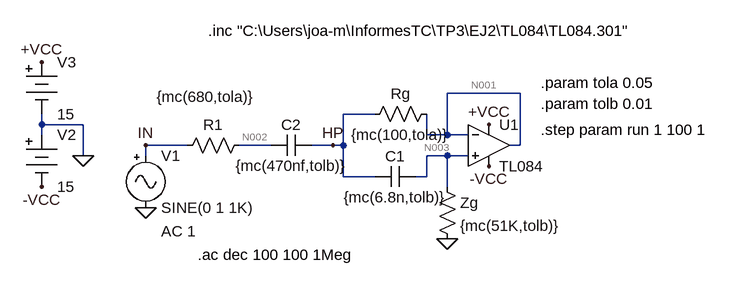
[diagram p0: schematic gyrator_Highpass_montecarlo.asc]
gyrator_Highpass_montecarlo.asc, the LTspice schematic file:
Version 4
SHEET 1 880 680
WIRE 192 80 80 80
WIRE -32 112 -80 112
WIRE -544 128 -544 112
WIRE -480 128 -544 128
WIRE -544 144 -544 128
WIRE 48 144 48 112
WIRE 80 144 80 80
WIRE 80 144 48 144
WIRE 112 144 80 144
WIRE -320 160 -384 160
WIRE -192 160 -240 160
WIRE -96 160 -128 160
WIRE -80 160 -80 112
WIRE -80 160 -96 160
WIRE 192 160 192 80
WIRE 192 160 176 160
WIRE -480 176 -480 128
WIRE -384 176 -384 160
WIRE 80 176 48 176
WIRE 112 176 80 176
WIRE -80 208 -80 160
WIRE -32 208 -80 208
WIRE 48 208 48 176
WIRE 48 208 32 208
WIRE 80 224 80 176
FLAG 80 304 0
FLAG -384 256 0
FLAG -544 32 +VCC
FLAG -544 224 -VCC
FLAG -480 176 0
FLAG -96 160 HP
FLAG -384 160 IN
FLAG 144 128 +VCC
FLAG 144 192 -VCC
SYMBOL res 64 96 R90
WINDOW 0 0 56 VBottom 2
WINDOW 3 32 56 VTop 2
SYMATTR InstName Rg
SYMATTR Value {mc(100,tola)}
SYMBOL res 64 208 R0
SYMATTR InstName Zg
SYMATTR Value {mc(51K,tolb)}
SYMBOL cap 32 192 R90
WINDOW 0 0 32 VBottom 2
WINDOW 3 32 32 VTop 2
SYMATTR InstName C1
SYMATTR Value {mc(6.8n,tolb)}
SYMBOL res -224 144 R90
WINDOW 0 0 56 VBottom 2
WINDOW 3 -74 67 VTop 2
SYMATTR InstName R1
SYMATTR Value {mc(680,tola)}
SYMBOL cap -128 144 R90
WINDOW 0 0 32 VBottom 2
WINDOW 3 32 32 VTop 2
SYMATTR InstName C2
SYMATTR Value {mc(470nf,tolb)}
SYMBOL Misc\\signal -384 160 R0
WINDOW 123 24 132 Left 2
WINDOW 39 0 0 Left 0
SYMATTR Value2 AC 1
SYMATTR InstName V1
SYMBOL Misc\\battery -544 128 R0
WINDOW 123 0 0 Left 0
WINDOW 39 0 0 Left 0
SYMATTR InstName V2
SYMATTR Value 15
SYMBOL Misc\\battery -544 16 R0
WINDOW 123 0 0 Left 0
WINDOW 39 0 0 Left 0
SYMATTR InstName V3
SYMATTR Value 15
SYMBOL Opamps\\opamp2 144 96 R0
SYMATTR InstName U1
SYMATTR Value TL084
SYMATTR SpiceModel TL084
TEXT -304 328 Left 2 !.ac dec 100 100 1Meg
TEXT -288 -16 Left 2 !.inc "C:\\Users\\joa-m\\InformesTC\\TP3\\EJ2\\TL084\\TL084.301"
TEXT 224 64 Left 2 !.param tola 0.05
TEXT 224 96 Left 2 !.param tolb 0.01
TEXT 224 136 Left 2 !.step param run 1 100 1

The netlist it stands for:
* gyrator_Highpass_montecarlo.asc
Rg N001 HP {mc(100,tola)}
R§Zg N003 0 {mc(51K,tolb)}
C1 N003 HP {mc(6.8n,tolb)}
R1 N002 IN {mc(680,tola)}
C2 HP N002 {mc(470nf,tolb)}
V1 IN 0 SINE(0 1 1K) AC 1
V2 0 -VCC 15
V3 +VCC 0 15
XU1 N003 N001 +VCC -VCC N001 TL084 TL084  ; pins In+ In- V+ V- OUT
.ac dec 100 100 1Meg
.inc "C:\Users\joa-m\InformesTC\TP3\EJ2\TL084\TL084.301"
.param tola 0.05
.param tolb 0.01
.step param run 1 100 1
.backanno
.end

* Results of the author's LTspice run, read from the files saved beside the schematic
* Operating Point, zero values left out:
*   V(n001) = 8.673 µV
*   V(hp) = 8.673 µV
*   V(n003) = -2.298 µV
*   V(-vcc) = -15 V
*   V(+vcc) = 15 V
*   I(Zg) = -45.05 pA
*   I(V3) = -14.19 mA
*   I(V2) = -14.19 mA
*   Ix(u1:1) = 45.05 pA
*   Ix(u1:2) = 45.05 pA
*   Ix(u1:3) = 14.19 mA
*   Ix(u1:4) = -14.19 mA
*   Ix(u1:5) = -45.05 pA
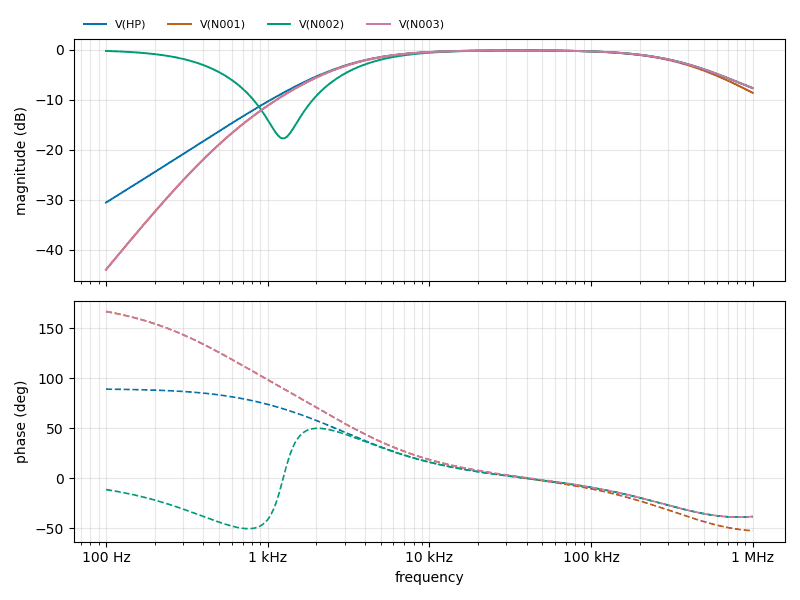
[diagram p1: AC Analysis of gyrator_Highpass_montecarlo.asc, plotted from the saved traces]
* AC Analysis, 1 run:
*   V(HP): -30.56 dB at 100 Hz, -7.66 dB at 1 MHz, peak -0.12 dB at 35.48 kHz, 3 dB below the peak at 3.024 kHz and 420.8 kHz
*   V(N001): -44.00 dB at 100 Hz, -8.60 dB at 1 MHz, peak -0.12 dB at 34.67 kHz, 3 dB below the peak at 3.089 kHz and 404 kHz
*   V(N002): -0.22 dB at 100 Hz, -7.66 dB at 1 MHz, peak -0.12 dB at 38.02 kHz, 3 dB below the peak at 3.845 kHz and 421.8 kHz
*   V(N003): -44.00 dB at 100 Hz, -7.66 dB at 1 MHz, peak -0.12 dB at 35.48 kHz, 3 dB below the peak at 3.09 kHz and 420.9 kHz